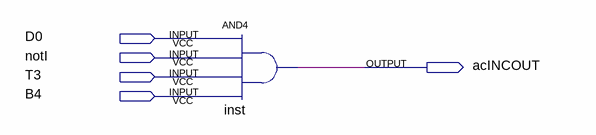
[diagram p0: schematic sheet]
// Quartus schematic acINC.bdf as structural Verilog: 1 symbols, 5 pins
module acINC (
  input  D0,
  input  notI,
  input  T3,
  input  B4,
  output acINCOUT
);

  and inst (acINCOUT, D0, notI, T3, B4);
endmodule
